# EAGLE schematic M1709 (EAGLE 6.6.0)

## Sheet 1 of 3
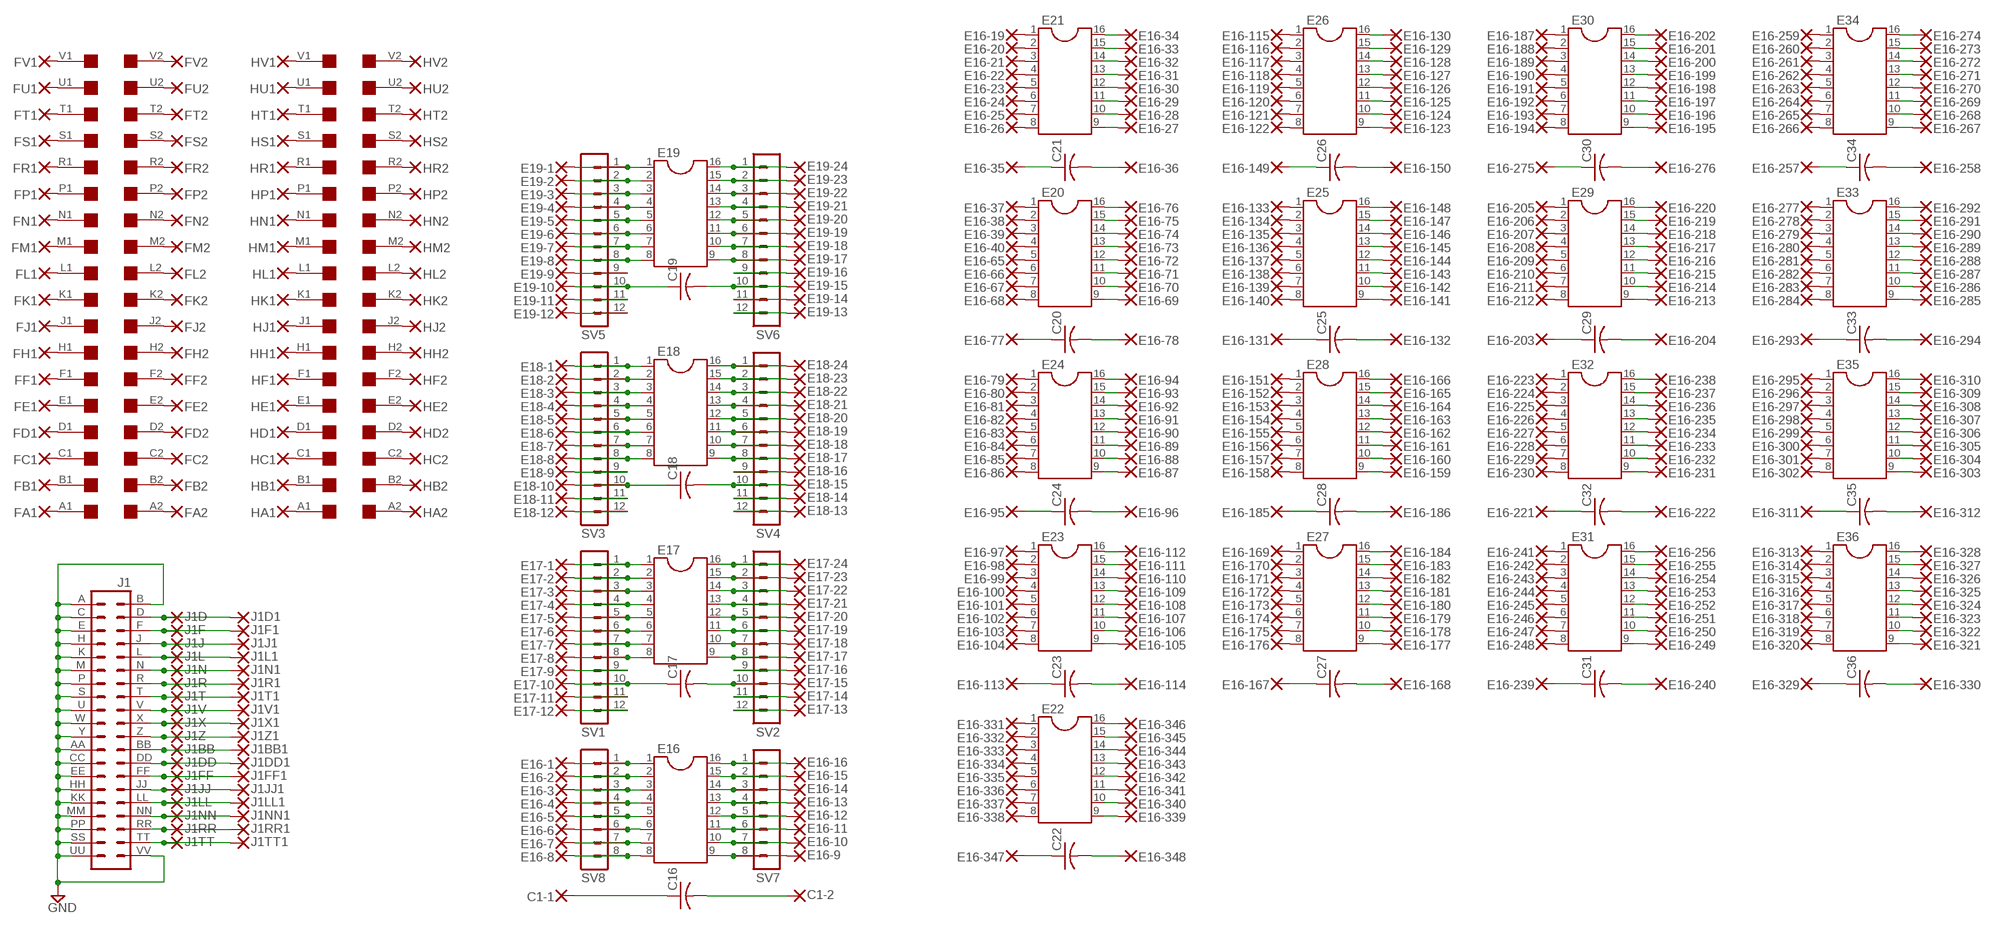
[diagram p0: schematic, sheet 1]

### Parts
C1-1  1,6/0,8  [1,6/0,8]
C1-2  1,6/0,8  [1,6/0,8]
C16  C-US075-032X103  [C075-032X103]
C17  C-US075-032X103  [C075-032X103]
C18  C-US075-032X103  [C075-032X103]
C19  C-US075-032X103  [C075-032X103]
C20  C-US075-032X103  [C075-032X103]
C21  C-US075-032X103  [C075-032X103]
C22  C-US075-032X103  [C075-032X103]
C23  C-US075-032X103  [C075-032X103]
C24  C-US075-032X103  [C075-032X103]
C25  C-US075-032X103  [C075-032X103]
C26  C-US075-032X103  [C075-032X103]
C27  C-US075-032X103  [C075-032X103]
C28  C-US075-032X103  [C075-032X103]
C29  C-US075-032X103  [C075-032X103]
C30  C-US075-032X103  [C075-032X103]
C31  C-US075-032X103  [C075-032X103]
C32  C-US075-032X103  [C075-032X103]
C33  C-US075-032X103  [C075-032X103]
C34  C-US075-032X103  [C075-032X103]
C35  C-US075-032X103  [C075-032X103]
C36  C-US075-032X103  [C075-032X103]
E16  DIL16  [DIL16]
E16-1  1,6/0,8  [1,6/0,8]
E16-2  1,6/0,8  [1,6/0,8]
E16-3  1,6/0,8  [1,6/0,8]
E16-4  1,6/0,8  [1,6/0,8]
E16-5  1,6/0,8  [1,6/0,8]
E16-6  1,6/0,8  [1,6/0,8]
E16-7  1,6/0,8  [1,6/0,8]
E16-8  1,6/0,8  [1,6/0,8]
E16-9  1,6/0,8  [1,6/0,8]
E16-10  1,6/0,8  [1,6/0,8]
E16-11  1,6/0,8  [1,6/0,8]
E16-12  1,6/0,8  [1,6/0,8]
E16-13  1,6/0,8  [1,6/0,8]
E16-14  1,6/0,8  [1,6/0,8]
E16-15  1,6/0,8  [1,6/0,8]
E16-16  1,6/0,8  [1,6/0,8]
E16-19  2,54/0,8  [2,54/0,8]
E16-20  2,54/0,8  [2,54/0,8]
E16-21  2,54/0,8  [2,54/0,8]
E16-22  2,54/0,8  [2,54/0,8]
E16-23  2,54/0,8  [2,54/0,8]
E16-24  2,54/0,8  [2,54/0,8]
E16-25  2,54/0,8  [2,54/0,8]
E16-26  2,54/0,8  [2,54/0,8]
E16-27  2,54/0,8  [2,54/0,8]
E16-28  2,54/0,8  [2,54/0,8]
E16-29  2,54/0,8  [2,54/0,8]
E16-30  2,54/0,8  [2,54/0,8]
E16-31  2,54/0,8  [2,54/0,8]
E16-32  2,54/0,8  [2,54/0,8]
E16-33  2,54/0,8  [2,54/0,8]
E16-34  2,54/0,8  [2,54/0,8]
E16-35  2,54/0,8  [2,54/0,8]
E16-36  2,54/0,8  [2,54/0,8]
E16-37  2,54/0,8  [2,54/0,8]
E16-38  2,54/0,8  [2,54/0,8]
E16-39  2,54/0,8  [2,54/0,8]
E16-40  2,54/0,8  [2,54/0,8]
E16-65  2,54/0,8  [2,54/0,8]
E16-66  2,54/0,8  [2,54/0,8]
E16-67  2,54/0,8  [2,54/0,8]
E16-68  2,54/0,8  [2,54/0,8]
E16-69  2,54/0,8  [2,54/0,8]
E16-70  2,54/0,8  [2,54/0,8]
E16-71  2,54/0,8  [2,54/0,8]
E16-72  2,54/0,8  [2,54/0,8]
E16-73  2,54/0,8  [2,54/0,8]
E16-74  2,54/0,8  [2,54/0,8]
E16-75  2,54/0,8  [2,54/0,8]
E16-76  2,54/0,8  [2,54/0,8]
E16-77  2,54/0,8  [2,54/0,8]
E16-78  2,54/0,8  [2,54/0,8]
E16-79  2,54/0,8  [2,54/0,8]
E16-80  2,54/0,8  [2,54/0,8]
E16-81  2,54/0,8  [2,54/0,8]
E16-82  2,54/0,8  [2,54/0,8]
E16-83  2,54/0,8  [2,54/0,8]
E16-84  2,54/0,8  [2,54/0,8]
E16-85  2,54/0,8  [2,54/0,8]
E16-86  2,54/0,8  [2,54/0,8]
E16-87  2,54/0,8  [2,54/0,8]
E16-88  2,54/0,8  [2,54/0,8]
E16-89  2,54/0,8  [2,54/0,8]
E16-90  2,54/0,8  [2,54/0,8]
E16-91  2,54/0,8  [2,54/0,8]
E16-92  2,54/0,8  [2,54/0,8]
E16-93  2,54/0,8  [2,54/0,8]
E16-94  2,54/0,8  [2,54/0,8]
E16-95  2,54/0,8  [2,54/0,8]
E16-96  2,54/0,8  [2,54/0,8]
E16-97  2,54/0,8  [2,54/0,8]
E16-98  2,54/0,8  [2,54/0,8]
E16-99  2,54/0,8  [2,54/0,8]
E16-100  2,54/0,8  [2,54/0,8]
E16-101  2,54/0,8  [2,54/0,8]
E16-102  2,54/0,8  [2,54/0,8]
E16-103  2,54/0,8  [2,54/0,8]
E16-104  2,54/0,8  [2,54/0,8]
E16-105  2,54/0,8  [2,54/0,8]
E16-106  2,54/0,8  [2,54/0,8]
E16-107  2,54/0,8  [2,54/0,8]
E16-108  2,54/0,8  [2,54/0,8]
E16-109  2,54/0,8  [2,54/0,8]
E16-110  2,54/0,8  [2,54/0,8]
E16-111  2,54/0,8  [2,54/0,8]
E16-112  2,54/0,8  [2,54/0,8]
E16-113  2,54/0,8  [2,54/0,8]
E16-114  2,54/0,8  [2,54/0,8]
E16-115  2,54/0,8  [2,54/0,8]
E16-116  2,54/0,8  [2,54/0,8]
E16-117  2,54/0,8  [2,54/0,8]
E16-118  2,54/0,8  [2,54/0,8]
E16-119  2,54/0,8  [2,54/0,8]
E16-120  2,54/0,8  [2,54/0,8]
E16-121  2,54/0,8  [2,54/0,8]
E16-122  2,54/0,8  [2,54/0,8]
E16-123  2,54/0,8  [2,54/0,8]
E16-124  2,54/0,8  [2,54/0,8]
E16-125  2,54/0,8  [2,54/0,8]
E16-126  2,54/0,8  [2,54/0,8]
E16-127  2,54/0,8  [2,54/0,8]
E16-128  2,54/0,8  [2,54/0,8]
E16-129  2,54/0,8  [2,54/0,8]
E16-130  2,54/0,8  [2,54/0,8]
E16-131  2,54/0,8  [2,54/0,8]
E16-132  2,54/0,8  [2,54/0,8]
E16-133  2,54/0,8  [2,54/0,8]
E16-134  2,54/0,8  [2,54/0,8]
E16-135  2,54/0,8  [2,54/0,8]
E16-136  2,54/0,8  [2,54/0,8]
E16-137  2,54/0,8  [2,54/0,8]
E16-138  2,54/0,8  [2,54/0,8]
E16-139  2,54/0,8  [2,54/0,8]
E16-140  2,54/0,8  [2,54/0,8]
E16-141  2,54/0,8  [2,54/0,8]
E16-142  2,54/0,8  [2,54/0,8]
E16-143  2,54/0,8  [2,54/0,8]
E16-144  2,54/0,8  [2,54/0,8]
E16-145  2,54/0,8  [2,54/0,8]
E16-146  2,54/0,8  [2,54/0,8]
E16-147  2,54/0,8  [2,54/0,8]
E16-148  2,54/0,8  [2,54/0,8]
E16-149  2,54/0,8  [2,54/0,8]
E16-150  2,54/0,8  [2,54/0,8]
E16-151  2,54/0,8  [2,54/0,8]
E16-152  2,54/0,8  [2,54/0,8]
E16-153  2,54/0,8  [2,54/0,8]
E16-154  2,54/0,8  [2,54/0,8]
E16-155  2,54/0,8  [2,54/0,8]
E16-156  2,54/0,8  [2,54/0,8]
E16-157  2,54/0,8  [2,54/0,8]
E16-158  2,54/0,8  [2,54/0,8]
E16-159  2,54/0,8  [2,54/0,8]
E16-160  2,54/0,8  [2,54/0,8]
E16-161  2,54/0,8  [2,54/0,8]
E16-162  2,54/0,8  [2,54/0,8]
E16-163  2,54/0,8  [2,54/0,8]
E16-164  2,54/0,8  [2,54/0,8]
E16-165  2,54/0,8  [2,54/0,8]
E16-166  2,54/0,8  [2,54/0,8]
E16-167  2,54/0,8  [2,54/0,8]
E16-168  2,54/0,8  [2,54/0,8]
E16-169  2,54/0,8  [2,54/0,8]
E16-170  2,54/0,8  [2,54/0,8]
E16-171  2,54/0,8  [2,54/0,8]
E16-172  2,54/0,8  [2,54/0,8]
E16-173  2,54/0,8  [2,54/0,8]
E16-174  2,54/0,8  [2,54/0,8]
E16-175  2,54/0,8  [2,54/0,8]
E16-176  2,54/0,8  [2,54/0,8]
E16-177  2,54/0,8  [2,54/0,8]
E16-178  2,54/0,8  [2,54/0,8]
E16-179  2,54/0,8  [2,54/0,8]
E16-180  2,54/0,8  [2,54/0,8]
E16-181  2,54/0,8  [2,54/0,8]
E16-182  2,54/0,8  [2,54/0,8]
E16-183  2,54/0,8  [2,54/0,8]
E16-184  2,54/0,8  [2,54/0,8]
E16-185  2,54/0,8  [2,54/0,8]
E16-186  2,54/0,8  [2,54/0,8]
E16-187  2,54/0,8  [2,54/0,8]
E16-188  2,54/0,8  [2,54/0,8]
E16-189  2,54/0,8  [2,54/0,8]
E16-190  2,54/0,8  [2,54/0,8]
E16-191  2,54/0,8  [2,54/0,8]
E16-192  2,54/0,8  [2,54/0,8]
E16-193  2,54/0,8  [2,54/0,8]
E16-194  2,54/0,8  [2,54/0,8]
E16-195  2,54/0,8  [2,54/0,8]
E16-196  2,54/0,8  [2,54/0,8]
E16-197  2,54/0,8  [2,54/0,8]
E16-198  2,54/0,8  [2,54/0,8]
E16-199  2,54/0,8  [2,54/0,8]
E16-200  2,54/0,8  [2,54/0,8]
E16-201  2,54/0,8  [2,54/0,8]
E16-202  2,54/0,8  [2,54/0,8]
E16-203  2,54/0,8  [2,54/0,8]
E16-204  2,54/0,8  [2,54/0,8]
E16-205  2,54/0,8  [2,54/0,8]
E16-206  2,54/0,8  [2,54/0,8]
E16-207  2,54/0,8  [2,54/0,8]
E16-208  2,54/0,8  [2,54/0,8]
E16-209  2,54/0,8  [2,54/0,8]
E16-210  2,54/0,8  [2,54/0,8]
E16-211  2,54/0,8  [2,54/0,8]
E16-212  2,54/0,8  [2,54/0,8]
E16-213  2,54/0,8  [2,54/0,8]
E16-214  2,54/0,8  [2,54/0,8]
E16-215  2,54/0,8  [2,54/0,8]
E16-216  2,54/0,8  [2,54/0,8]
E16-217  2,54/0,8  [2,54/0,8]
E16-218  2,54/0,8  [2,54/0,8]
E16-219  2,54/0,8  [2,54/0,8]
E16-220  2,54/0,8  [2,54/0,8]
E16-221  2,54/0,8  [2,54/0,8]
E16-222  2,54/0,8  [2,54/0,8]
E16-223  2,54/0,8  [2,54/0,8]
E16-224  2,54/0,8  [2,54/0,8]
E16-225  2,54/0,8  [2,54/0,8]
E16-226  2,54/0,8  [2,54/0,8]
E16-227  2,54/0,8  [2,54/0,8]
E16-228  2,54/0,8  [2,54/0,8]
E16-229  2,54/0,8  [2,54/0,8]
E16-230  2,54/0,8  [2,54/0,8]
E16-231  2,54/0,8  [2,54/0,8]
E16-232  2,54/0,8  [2,54/0,8]
E16-233  2,54/0,8  [2,54/0,8]
E16-234  2,54/0,8  [2,54/0,8]
E16-235  2,54/0,8  [2,54/0,8]
E16-236  2,54/0,8  [2,54/0,8]
E16-237  2,54/0,8  [2,54/0,8]
E16-238  2,54/0,8  [2,54/0,8]
E16-239  2,54/0,8  [2,54/0,8]
E16-240  2,54/0,8  [2,54/0,8]
E16-241  2,54/0,8  [2,54/0,8]
E16-242  2,54/0,8  [2,54/0,8]
E16-243  2,54/0,8  [2,54/0,8]
E16-244  2,54/0,8  [2,54/0,8]
E16-245  2,54/0,8  [2,54/0,8]
E16-246  2,54/0,8  [2,54/0,8]
E16-247  2,54/0,8  [2,54/0,8]
E16-248  2,54/0,8  [2,54/0,8]
E16-249  2,54/0,8  [2,54/0,8]
E16-250  2,54/0,8  [2,54/0,8]
E16-251  2,54/0,8  [2,54/0,8]
E16-252  2,54/0,8  [2,54/0,8]
E16-253  2,54/0,8  [2,54/0,8]
E16-254  2,54/0,8  [2,54/0,8]
E16-255  2,54/0,8  [2,54/0,8]
E16-256  2,54/0,8  [2,54/0,8]
E16-257  2,54/0,8  [2,54/0,8]
E16-258  2,54/0,8  [2,54/0,8]
E16-259  2,54/0,8  [2,54/0,8]
E16-260  2,54/0,8  [2,54/0,8]
E16-261  2,54/0,8  [2,54/0,8]
E16-262  2,54/0,8  [2,54/0,8]
E16-263  2,54/0,8  [2,54/0,8]
E16-264  2,54/0,8  [2,54/0,8]
E16-265  2,54/0,8  [2,54/0,8]
E16-266  2,54/0,8  [2,54/0,8]
E16-267  2,54/0,8  [2,54/0,8]
E16-268  2,54/0,8  [2,54/0,8]
E16-269  2,54/0,8  [2,54/0,8]
E16-270  2,54/0,8  [2,54/0,8]
E16-271  2,54/0,8  [2,54/0,8]
E16-272  2,54/0,8  [2,54/0,8]
E16-273  2,54/0,8  [2,54/0,8]
E16-274  2,54/0,8  [2,54/0,8]
E16-275  2,54/0,8  [2,54/0,8]
E16-276  2,54/0,8  [2,54/0,8]
E16-277  2,54/0,8  [2,54/0,8]
E16-278  2,54/0,8  [2,54/0,8]
E16-279  2,54/0,8  [2,54/0,8]
E16-280  2,54/0,8  [2,54/0,8]
E16-281  2,54/0,8  [2,54/0,8]
E16-282  2,54/0,8  [2,54/0,8]
E16-283  2,54/0,8  [2,54/0,8]
E16-284  2,54/0,8  [2,54/0,8]
E16-285  2,54/0,8  [2,54/0,8]
E16-286  2,54/0,8  [2,54/0,8]
E16-287  2,54/0,8  [2,54/0,8]
E16-288  2,54/0,8  [2,54/0,8]
E16-289  2,54/0,8  [2,54/0,8]
E16-290  2,54/0,8  [2,54/0,8]
E16-291  2,54/0,8  [2,54/0,8]
E16-292  2,54/0,8  [2,54/0,8]
E16-293  2,54/0,8  [2,54/0,8]
E16-294  2,54/0,8  [2,54/0,8]
E16-295  2,54/0,8  [2,54/0,8]
E16-296  2,54/0,8  [2,54/0,8]
E16-297  2,54/0,8  [2,54/0,8]
E16-298  2,54/0,8  [2,54/0,8]
E16-299  2,54/0,8  [2,54/0,8]
E16-300  2,54/0,8  [2,54/0,8]
E16-301  2,54/0,8  [2,54/0,8]
E16-302  2,54/0,8  [2,54/0,8]
E16-303  2,54/0,8  [2,54/0,8]
E16-304  2,54/0,8  [2,54/0,8]
E16-305  2,54/0,8  [2,54/0,8]
E16-306  2,54/0,8  [2,54/0,8]
E16-307  2,54/0,8  [2,54/0,8]
E16-308  2,54/0,8  [2,54/0,8]
E16-309  2,54/0,8  [2,54/0,8]
E16-310  2,54/0,8  [2,54/0,8]
E16-311  2,54/0,8  [2,54/0,8]
E16-312  2,54/0,8  [2,54/0,8]
E16-313  2,54/0,8  [2,54/0,8]
E16-314  2,54/0,8  [2,54/0,8]
E16-315  2,54/0,8  [2,54/0,8]
E16-316  2,54/0,8  [2,54/0,8]
E16-317  2,54/0,8  [2,54/0,8]
E16-318  2,54/0,8  [2,54/0,8]
E16-319  2,54/0,8  [2,54/0,8]
E16-320  2,54/0,8  [2,54/0,8]
E16-321  2,54/0,8  [2,54/0,8]
E16-322  2,54/0,8  [2,54/0,8]
E16-323  2,54/0,8  [2,54/0,8]
E16-324  2,54/0,8  [2,54/0,8]
E16-325  2,54/0,8  [2,54/0,8]
E16-326  2,54/0,8  [2,54/0,8]
E16-327  2,54/0,8  [2,54/0,8]
E16-328  2,54/0,8  [2,54/0,8]
E16-329  2,54/0,8  [2,54/0,8]
E16-330  2,54/0,8  [2,54/0,8]
E16-331  2,54/0,8  [2,54/0,8]
E16-332  2,54/0,8  [2,54/0,8]
E16-333  2,54/0,8  [2,54/0,8]
E16-334  2,54/0,8  [2,54/0,8]
E16-335  2,54/0,8  [2,54/0,8]
E16-336  2,54/0,8  [2,54/0,8]
E16-337  2,54/0,8  [2,54/0,8]
E16-338  2,54/0,8  [2,54/0,8]
E16-339  2,54/0,8  [2,54/0,8]
E16-340  2,54/0,8  [2,54/0,8]
E16-341  2,54/0,8  [2,54/0,8]
E16-342  2,54/0,8  [2,54/0,8]
E16-343  2,54/0,8  [2,54/0,8]
E16-344  2,54/0,8  [2,54/0,8]
E16-345  2,54/0,8  [2,54/0,8]
E16-346  2,54/0,8  [2,54/0,8]
E16-347  2,54/0,8  [2,54/0,8]
E16-348  2,54/0,8  [2,54/0,8]
E17  DIL16  [DIL16]
E17-1  1,6/0,8  [1,6/0,8]
E17-2  1,6/0,8  [1,6/0,8]
E17-3  1,6/0,8  [1,6/0,8]
E17-4  1,6/0,8  [1,6/0,8]
E17-5  1,6/0,8  [1,6/0,8]
E17-6  1,6/0,8  [1,6/0,8]
E17-7  1,6/0,8  [1,6/0,8]
E17-8  1,6/0,8  [1,6/0,8]
E17-9  1,6/0,8  [1,6/0,8]
E17-10  1,6/0,8  [1,6/0,8]
E17-11  1,6/0,8  [1,6/0,8]
E17-12  1,6/0,8  [1,6/0,8]
E17-13  1,6/0,8  [1,6/0,8]
E17-14  1,6/0,8  [1,6/0,8]
E17-15  1,6/0,8  [1,6/0,8]
E17-16  1,6/0,8  [1,6/0,8]
E17-17  1,6/0,8  [1,6/0,8]
E17-18  1,6/0,8  [1,6/0,8]
E17-19  1,6/0,8  [1,6/0,8]
E17-20  1,6/0,8  [1,6/0,8]
E17-21  1,6/0,8  [1,6/0,8]
E17-22  1,6/0,8  [1,6/0,8]
E17-23  1,6/0,8  [1,6/0,8]
E17-24  1,6/0,8  [1,6/0,8]
E18  DIL16  [DIL16]
E18-1  1,6/0,8  [1,6/0,8]
E18-2  1,6/0,8  [1,6/0,8]
E18-3  1,6/0,8  [1,6/0,8]
E18-4  1,6/0,8  [1,6/0,8]
E18-5  1,6/0,8  [1,6/0,8]
E18-6  1,6/0,8  [1,6/0,8]
E18-7  1,6/0,8  [1,6/0,8]
E18-8  1,6/0,8  [1,6/0,8]
E18-9  1,6/0,8  [1,6/0,8]
E18-10  1,6/0,8  [1,6/0,8]
E18-11  1,6/0,8  [1,6/0,8]
E18-12  1,6/0,8  [1,6/0,8]
E18-13  1,6/0,8  [1,6/0,8]
E18-14  1,6/0,8  [1,6/0,8]
E18-15  1,6/0,8  [1,6/0,8]
E18-16  1,6/0,8  [1,6/0,8]
E18-17  1,6/0,8  [1,6/0,8]
E18-18  1,6/0,8  [1,6/0,8]
E18-19  1,6/0,8  [1,6/0,8]
E18-20  1,6/0,8  [1,6/0,8]
E18-21  1,6/0,8  [1,6/0,8]
E18-22  1,6/0,8  [1,6/0,8]
E18-23  1,6/0,8  [1,6/0,8]
E18-24  1,6/0,8  [1,6/0,8]
E19  DIL16  [DIL16]
E19-1  1,6/0,8  [1,6/0,8]
E19-2  1,6/0,8  [1,6/0,8]
E19-3  1,6/0,8  [1,6/0,8]
E19-4  1,6/0,8  [1,6/0,8]
E19-5  1,6/0,8  [1,6/0,8]
E19-6  1,6/0,8  [1,6/0,8]
E19-7  1,6/0,8  [1,6/0,8]
E19-8  1,6/0,8  [1,6/0,8]
E19-9  1,6/0,8  [1,6/0,8]
E19-10  1,6/0,8  [1,6/0,8]
E19-11  1,6/0,8  [1,6/0,8]
E19-12  1,6/0,8  [1,6/0,8]
E19-13  1,6/0,8  [1,6/0,8]
E19-14  1,6/0,8  [1,6/0,8]
E19-15  1,6/0,8  [1,6/0,8]
E19-16  1,6/0,8  [1,6/0,8]
E19-17  1,6/0,8  [1,6/0,8]
E19-18  1,6/0,8  [1,6/0,8]
E19-19  1,6/0,8  [1,6/0,8]
E19-20  1,6/0,8  [1,6/0,8]
E19-21  1,6/0,8  [1,6/0,8]
E19-22  1,6/0,8  [1,6/0,8]
E19-23  1,6/0,8  [1,6/0,8]
E19-24  1,6/0,8  [1,6/0,8]
E20  DIL16  [DIL16]
E21  DIL16  [DIL16]
E22  DIL16  [DIL16]
E23  DIL16  [DIL16]
E24  DIL16  [DIL16]
E25  DIL16  [DIL16]
E26  DIL16  [DIL16]
E27  DIL16  [DIL16]
E28  DIL16  [DIL16]
E29  DIL16  [DIL16]
E30  DIL16  [DIL16]
E31  DIL16  [DIL16]
E32  DIL16  [DIL16]
E33  DIL16  [DIL16]
E34  DIL16  [DIL16]
E35  DIL16  [DIL16]
E36  DIL16  [DIL16]
F  SINGLE  [EDGE-CON2]
FA1  2,54/0,8  [2,54/0,8]
FA2  2,54/0,8  [2,54/0,8]
FB1  2,54/0,8  [2,54/0,8]
FB2  2,54/0,8  [2,54/0,8]
FC1  2,54/0,8  [2,54/0,8]
FC2  2,54/0,8  [2,54/0,8]
FD1  2,54/0,8  [2,54/0,8]
FD2  2,54/0,8  [2,54/0,8]
FE1  2,54/0,8  [2,54/0,8]
FE2  2,54/0,8  [2,54/0,8]
FF1  2,54/0,8  [2,54/0,8]
FF2  2,54/0,8  [2,54/0,8]
FH1  2,54/0,8  [2,54/0,8]
FH2  2,54/0,8  [2,54/0,8]
FJ1  2,54/0,8  [2,54/0,8]
FJ2  2,54/0,8  [2,54/0,8]
FK1  2,54/0,8  [2,54/0,8]
FK2  2,54/0,8  [2,54/0,8]
FL1  2,54/0,8  [2,54/0,8]
FL2  2,54/0,8  [2,54/0,8]
FM1  2,54/0,8  [2,54/0,8]
FM2  2,54/0,8  [2,54/0,8]
FN1  2,54/0,8  [2,54/0,8]
FN2  2,54/0,8  [2,54/0,8]
FP1  2,54/0,8  [2,54/0,8]
FP2  2,54/0,8  [2,54/0,8]
FR1  2,54/0,8  [2,54/0,8]
FR2  2,54/0,8  [2,54/0,8]
FS1  2,54/0,8  [2,54/0,8]
FS2  2,54/0,8  [2,54/0,8]
FT1  2,54/0,8  [2,54/0,8]
FT2  2,54/0,8  [2,54/0,8]
FU1  2,54/0,8  [2,54/0,8]
FU2  2,54/0,8  [2,54/0,8]
FV1  2,54/0,8  [2,54/0,8]
FV2  2,54/0,8  [2,54/0,8]
H  SINGLE  [EDGE-CON2]
HA1  2,54/0,8  [2,54/0,8]
HA2  2,54/0,8  [2,54/0,8]
HB1  2,54/0,8  [2,54/0,8]
HB2  2,54/0,8  [2,54/0,8]
HC1  2,54/0,8  [2,54/0,8]
HC2  2,54/0,8  [2,54/0,8]
HD1  2,54/0,8  [2,54/0,8]
HD2  2,54/0,8  [2,54/0,8]
HE1  2,54/0,8  [2,54/0,8]
HE2  2,54/0,8  [2,54/0,8]
HF1  2,54/0,8  [2,54/0,8]
HF2  2,54/0,8  [2,54/0,8]
HH1  2,54/0,8  [2,54/0,8]
HH2  2,54/0,8  [2,54/0,8]
HJ1  2,54/0,8  [2,54/0,8]
HJ2  2,54/0,8  [2,54/0,8]
HK1  2,54/0,8  [2,54/0,8]
HK2  2,54/0,8  [2,54/0,8]
HL1  2,54/0,8  [2,54/0,8]
HL2  2,54/0,8  [2,54/0,8]
HM1  2,54/0,8  [2,54/0,8]
HM2  2,54/0,8  [2,54/0,8]
HN1  2,54/0,8  [2,54/0,8]
HN2  2,54/0,8  [2,54/0,8]
HP1  2,54/0,8  [2,54/0,8]
HP2  2,54/0,8  [2,54/0,8]
HR1  2,54/0,8  [2,54/0,8]
HR2  2,54/0,8  [2,54/0,8]
HS1  2,54/0,8  [2,54/0,8]
HS2  2,54/0,8  [2,54/0,8]
HT1  2,54/0,8  [2,54/0,8]
HT2  2,54/0,8  [2,54/0,8]
HU1  2,54/0,8  [2,54/0,8]
HU2  2,54/0,8  [2,54/0,8]
HV1  2,54/0,8  [2,54/0,8]
HV2  2,54/0,8  [2,54/0,8]
J1  DEC40PINH  [DEC40PINH]
J1BB  2,54/0,8  [2,54/0,8]
J1BB1  2,54/0,8  [2,54/0,8]
J1D  2,54/0,8  [2,54/0,8]
J1D1  2,54/0,8  [2,54/0,8]
J1DD  2,54/0,8  [2,54/0,8]
J1DD1  2,54/0,8  [2,54/0,8]
J1F  2,54/0,8  [2,54/0,8]
J1F1  2,54/0,8  [2,54/0,8]
J1FF  2,54/0,8  [2,54/0,8]
J1FF1  2,54/0,8  [2,54/0,8]
J1J  2,54/0,8  [2,54/0,8]
J1J1  2,54/0,8  [2,54/0,8]
J1JJ  2,54/0,8  [2,54/0,8]
J1JJ1  2,54/0,8  [2,54/0,8]
J1L  2,54/0,8  [2,54/0,8]
J1L1  2,54/0,8  [2,54/0,8]
J1LL  2,54/0,8  [2,54/0,8]
J1LL1  2,54/0,8  [2,54/0,8]
J1N  2,54/0,8  [2,54/0,8]
J1N1  2,54/0,8  [2,54/0,8]
J1NN  2,54/0,8  [2,54/0,8]
J1NN1  2,54/0,8  [2,54/0,8]
J1R  2,54/0,8  [2,54/0,8]
J1R1  2,54/0,8  [2,54/0,8]
J1RR  2,54/0,8  [2,54/0,8]
J1RR1  2,54/0,8  [2,54/0,8]
J1T  2,54/0,8  [2,54/0,8]
J1T1  2,54/0,8  [2,54/0,8]
J1TT  2,54/0,8  [2,54/0,8]
J1TT1  2,54/0,8  [2,54/0,8]
J1V  2,54/0,8  [2,54/0,8]
J1V1  2,54/0,8  [2,54/0,8]
J1X  2,54/0,8  [2,54/0,8]
J1X1  2,54/0,8  [2,54/0,8]
J1Z  2,54/0,8  [2,54/0,8]
J1Z1  2,54/0,8  [2,54/0,8]
SV1  MA12-1  [MA12-1]
SV2  MA12-1  [MA12-1]
SV3  MA12-1  [MA12-1]
SV4  MA12-1  [MA12-1]
SV5  MA12-1  [MA12-1]
SV6  MA12-1  [MA12-1]
SV7  MA08-1  [MA08-1]
SV8  MA08-1  [MA08-1]

### Nets
GND: J1.A J1.AA J1.B J1.C J1.CC J1.E J1.EE J1.H J1.HH J1.K J1.KK J1.M J1.MM J1.P J1.PP J1.S J1.SS J1.U J1.UU J1.VV J1.W J1.Y ; also sheet 2,3
N$1: J1.D J1D1.1(P) J1D.1(P)
N$2: J1.F J1F1.1(P) J1F.1(P)
N$3: J1.J J1J1.1(P) J1J.1(P)
N$4: J1.L J1L1.1(P) J1L.1(P)
N$5: J1.N J1N1.1(P) J1N.1(P)
N$6: J1.R J1R1.1(P) J1R.1(P)
N$7: J1.T J1T1.1(P) J1T.1(P)
N$8: J1.V J1V1.1(P) J1V.1(P)
N$9: J1.X J1X1.1(P) J1X.1(P)
N$10: J1.Z J1Z1.1(P) J1Z.1(P)
N$11: J1.BB J1BB1.1(P) J1BB.1(P)
N$12: J1.DD J1DD1.1(P) J1DD.1(P)
N$13: J1.FF J1FF1.1(P) J1FF.1(P)
N$14: J1.JJ J1JJ1.1(P) J1JJ.1(P)
N$15: J1.LL J1LL1.1(P) J1LL.1(P)
N$16: J1.NN J1NN1.1(P) J1NN.1(P)
N$17: J1.RR J1RR1.1(P) J1RR.1(P)
N$18: J1.TT J1TT1.1(P) J1TT.1(P)
N$19: F.A1 FA1.1(P)
N$20: F.B1 FB1.1(P)
N$21: F.C1 FC1.1(P)
N$22: F.D1 FD1.1(P)
N$23: F.E1 FE1.1(P)
N$24: F.F1 FF1.1(P)
N$25: F.H1 FH1.1(P)
N$26: F.J1 FJ1.1(P)
N$27: F.K1 FK1.1(P)
N$28: F.L1 FL1.1(P)
N$29: F.M1 FM1.1(P)
N$30: F.N1 FN1.1(P)
N$31: F.P1 FP1.1(P)
N$32: F.R1 FR1.1(P)
N$33: F.S1 FS1.1(P)
N$34: F.T1 FT1.1(P)
N$35: F.U1 FU1.1(P)
N$36: F.V1 FV1.1(P)
N$37: F.A2 FA2.1(P)
N$38: F.B2 FB2.1(P)
N$39: F.C2 FC2.1(P)
N$40: F.D2 FD2.1(P)
N$41: F.E2 FE2.1(P)
N$42: F.F2 FF2.1(P)
N$43: F.H2 FH2.1(P)
N$44: F.J2 FJ2.1(P)
N$45: F.K2 FK2.1(P)
N$46: F.L2 FL2.1(P)
N$47: F.M2 FM2.1(P)
N$48: F.N2 FN2.1(P)
N$49: F.P2 FP2.1(P)
N$50: F.R2 FR2.1(P)
N$51: F.S2 FS2.1(P)
N$52: F.T2 FT2.1(P)
N$53: F.U2 FU2.1(P)
N$54: F.V2 FV2.1(P)
N$55: H.A2 HA2.1(P)
N$56: H.B2 HB2.1(P)
N$57: H.C2 HC2.1(P)
N$58: H.D2 HD2.1(P)
N$59: H.E2 HE2.1(P)
N$60: H.F2 HF2.1(P)
N$61: H.H2 HH2.1(P)
N$62: H.J2 HJ2.1(P)
N$63: H.K2 HK2.1(P)
N$64: H.L2 HL2.1(P)
N$65: H.M2 HM2.1(P)
N$66: H.N2 HN2.1(P)
N$67: H.P2 HP2.1(P)
N$68: H.R2 HR2.1(P)
N$69: H.S2 HS2.1(P)
N$70: H.T2 HT2.1(P)
N$71: H.U2 HU2.1(P)
N$72: H.V2 HV2.1(P)
N$73: H.A1 HA1.1(P)
N$74: H.B1 HB1.1(P)
N$75: H.C1 HC1.1(P)
N$76: H.D1 HD1.1(P)
N$77: H.E1 HE1.1(P)
N$78: H.F1 HF1.1(P)
N$79: H.H1 HH1.1(P)
N$80: H.J1 HJ1.1(P)
N$81: H.K1 HK1.1(P)
N$82: H.L1 HL1.1(P)
N$83: H.M1 HM1.1(P)
N$84: H.N1 HN1.1(P)
N$85: H.P1 HP1.1(P)
N$86: H.R1 HR1.1(P)
N$87: H.S1 HS1.1(P)
N$88: H.T1 HT1.1(P)
N$89: H.U1 HU1.1(P)
N$90: H.V1 HV1.1(P)
N$91: E17-1.1(P) E17.1 SV1.1
N$92: E17-2.1(P) E17.2 SV1.2
N$93: E17-3.1(P) E17.3 SV1.3
N$94: E17-4.1(P) E17.4 SV1.4
N$95: E17-5.1(P) E17.5 SV1.5
N$96: E17-6.1(P) E17.6 SV1.6
N$97: E17-7.1(P) E17.7 SV1.7
N$98: E17-8.1(P) E17.8 SV1.8
N$99: E17-9.1(P) SV1.9
N$100: C17.1 E17-10.1(P) SV1.10
N$101: C17.2 E17-15.1(P) SV2.10
N$102: E17-16.1(P) SV2.9
N$103: E17-17.1(P) E17.9 SV2.8
N$104: E17-18.1(P) E17.10 SV2.7
N$105: E17-19.1(P) E17.11 SV2.6
N$106: E17-20.1(P) E17.12 SV2.5
N$107: E17-21.1(P) E17.13 SV2.4
N$108: E17-22.1(P) E17.14 SV2.3
N$109: E17-23.1(P) E17.15 SV2.2
N$110: E17-24.1(P) E17.16 SV2.1
N$111: E18-11.1(P) SV3.11
N$112: E18-12.1(P) SV3.12
N$113: E18-13.1(P) SV4.12
N$114: E18-14.1(P) SV4.11
N$115: E18-1.1(P) E18.1 SV3.1
N$116: E18-2.1(P) E18.2 SV3.2
N$117: E17-11.1(P) SV1.11
N$118: E17-12.1(P) SV1.12
N$119: E16-1.1(P) E16.1 SV8.1
N$120: E16-2.1(P) E16.2 SV8.2
N$121: E16-3.1(P) E16.3 SV8.3
N$122: E16-4.1(P) E16.4 SV8.4
N$123: E16-5.1(P) E16.5 SV8.5
N$124: E16-6.1(P) E16.6 SV8.6
N$125: E16-7.1(P) E16.7 SV8.7
N$126: E16-8.1(P) E16.8 SV8.8
N$127: E16-9.1(P) E16.9 SV7.8
N$128: E16-10.1(P) E16.10 SV7.7
N$129: E16-11.1(P) E16.11 SV7.6
N$130: E16-12.1(P) E16.12 SV7.5
N$131: E16-13.1(P) E16.13 SV7.4
N$132: E16-14.1(P) E16.14 SV7.3
N$133: E16-15.1(P) E16.15 SV7.2
N$134: E16-16.1(P) E16.16 SV7.1
N$135: E17-13.1(P) SV2.12
N$136: E17-14.1(P) SV2.11
N$137: E18-3.1(P) E18.3 SV3.3
N$138: E18-4.1(P) E18.4 SV3.4
N$139: E18-5.1(P) E18.5 SV3.5
N$140: E18-6.1(P) E18.6 SV3.6
N$141: E18-7.1(P) E18.7 SV3.7
N$142: E18-8.1(P) E18.8 SV3.8
N$143: E18-9.1(P) SV3.9
N$144: C18.1 E18-10.1(P) SV3.10
N$145: C18.2 E18-15.1(P) SV4.10
N$146: E18-16.1(P) SV4.9
N$147: E18-17.1(P) E18.9 SV4.8
N$148: E18-18.1(P) E18.10 SV4.7
N$149: E18-19.1(P) E18.11 SV4.6
N$150: E18-20.1(P) E18.12 SV4.5
N$151: E18-21.1(P) E18.13 SV4.4
N$152: E18-22.1(P) E18.14 SV4.3
N$153: E18-23.1(P) E18.15 SV4.2
N$154: E18-24.1(P) E18.16 SV4.1
N$155: E19-11.1(P) SV5.11
N$156: E19-12.1(P) SV5.12
N$157: E19-13.1(P) SV6.12
N$158: E19-14.1(P) SV6.11
N$159: E19-1.1(P) E19.1 SV5.1
N$160: E19-2.1(P) E19.2 SV5.2
N$161: E19-3.1(P) E19.3 SV5.3
N$162: E19-4.1(P) E19.4 SV5.4
N$163: E19-5.1(P) E19.5 SV5.5
N$164: E19-6.1(P) E19.6 SV5.6
N$165: E19-7.1(P) E19.7 SV5.7
N$166: E19-8.1(P) E19.8 SV5.8
N$167: E19-9.1(P) SV5.9
N$168: C19.1 E19-10.1(P) SV5.10
N$169: C19.2 E19-15.1(P) SV6.10
N$170: E19-16.1(P) SV6.9
N$171: E19-17.1(P) E19.9 SV6.8
N$172: E19-18.1(P) E19.10 SV6.7
N$173: E19-19.1(P) E19.11 SV6.6
N$174: E19-20.1(P) E19.12 SV6.5
N$175: E19-21.1(P) E19.13 SV6.4
N$176: E19-22.1(P) E19.14 SV6.3
N$177: E19-23.1(P) E19.15 SV6.2
N$178: E19-24.1(P) E19.16 SV6.1
N$179: C1-1.1(P) C16.1
N$180: C1-2.1(P) C16.2
N$181: E16-19.1(P) E21.1
N$182: E16-20.1(P) E21.2
N$183: E16-21.1(P) E21.3
N$184: E16-22.1(P) E21.4
N$185: E16-23.1(P) E21.5
N$186: E16-24.1(P) E21.6
N$187: E16-25.1(P) E21.7
N$188: E16-26.1(P) E21.8
N$189: E16-27.1(P) E21.9
N$190: E16-28.1(P) E21.10
N$191: E16-29.1(P) E21.11
N$192: E16-30.1(P) E21.12
N$193: E16-31.1(P) E21.13
N$194: E16-32.1(P) E21.14
N$195: E16-33.1(P) E21.15
N$196: E16-34.1(P) E21.16
N$197: C21.1 E16-35.1(P)
N$198: C21.2 E16-36.1(P)
N$199: E16-37.1(P) E20.1
N$200: E16-38.1(P) E20.2
N$201: E16-39.1(P) E20.3
N$202: E16-40.1(P) E20.4
N$203: E16-65.1(P) E20.5
N$204: E16-66.1(P) E20.6
N$205: E16-67.1(P) E20.7
N$206: E16-68.1(P) E20.8
N$207: E16-69.1(P) E20.9
N$208: E16-70.1(P) E20.10
N$209: E16-71.1(P) E20.11
N$210: E16-72.1(P) E20.12
N$211: E16-73.1(P) E20.13
N$212: E16-74.1(P) E20.14
N$213: E16-75.1(P) E20.15
N$214: E16-76.1(P) E20.16
N$215: C20.1 E16-77.1(P)
N$216: C20.2 E16-78.1(P)
N$217: E16-79.1(P) E24.1
N$218: E16-80.1(P) E24.2
N$219: E16-81.1(P) E24.3
N$220: E16-82.1(P) E24.4
N$221: E16-83.1(P) E24.5
N$222: E16-84.1(P) E24.6
N$223: E16-85.1(P) E24.7
N$224: E16-86.1(P) E24.8
N$225: E16-87.1(P) E24.9
N$226: E16-88.1(P) E24.10
N$227: E16-89.1(P) E24.11
N$228: E16-90.1(P) E24.12
N$229: E16-91.1(P) E24.13
N$230: E16-92.1(P) E24.14
N$231: E16-93.1(P) E24.15
N$232: E16-94.1(P) E24.16
N$233: C24.1 E16-95.1(P)
N$234: C24.2 E16-96.1(P)
N$235: E16-97.1(P) E23.1
N$236: E16-98.1(P) E23.2
N$237: E16-99.1(P) E23.3
N$238: E16-100.1(P) E23.4
N$239: E16-101.1(P) E23.5
N$240: E16-102.1(P) E23.6
N$241: E16-103.1(P) E23.7
N$242: E16-104.1(P) E23.8
N$243: E16-105.1(P) E23.9
N$244: E16-106.1(P) E23.10
N$245: E16-107.1(P) E23.11
N$246: E16-108.1(P) E23.12
N$247: E16-109.1(P) E23.13
N$248: E16-110.1(P) E23.14
N$249: E16-111.1(P) E23.15
N$250: E16-112.1(P) E23.16
N$251: C23.1 E16-113.1(P)
N$252: C23.2 E16-114.1(P)
N$253: E16-115.1(P) E26.1
N$254: E16-116.1(P) E26.2
N$255: E16-117.1(P) E26.3
N$256: E16-118.1(P) E26.4
N$257: E16-119.1(P) E26.5
N$258: E16-120.1(P) E26.6
N$259: E16-121.1(P) E26.7
N$260: E16-122.1(P) E26.8
N$261: E16-123.1(P) E26.9
N$262: E16-124.1(P) E26.10
N$263: E16-125.1(P) E26.11
N$264: E16-126.1(P) E26.12
N$265: E16-127.1(P) E26.13
N$266: E16-128.1(P) E26.14
N$267: E16-129.1(P) E26.15
N$268: E16-130.1(P) E26.16
N$269: C25.1 E16-131.1(P)
N$270: C25.2 E16-132.1(P)
N$271: E16-133.1(P) E25.1
N$272: E16-134.1(P) E25.2
N$273: E16-135.1(P) E25.3
N$274: E16-136.1(P) E25.4
N$275: E16-137.1(P) E25.5
N$276: E16-138.1(P) E25.6
N$277: E16-139.1(P) E25.7
N$278: E16-140.1(P) E25.8
N$279: E16-141.1(P) E25.9
N$280: E16-142.1(P) E25.10
N$281: E16-143.1(P) E25.11
N$282: E16-144.1(P) E25.12
N$283: E16-145.1(P) E25.13
N$284: E16-146.1(P) E25.14
N$285: E16-147.1(P) E25.15
N$286: E16-148.1(P) E25.16
N$287: C26.1 E16-149.1(P)
N$288: C26.2 E16-150.1(P)
N$289: E16-151.1(P) E28.1
N$290: E16-152.1(P) E28.2
N$291: E16-153.1(P) E28.3
N$292: E16-154.1(P) E28.4
N$293: E16-155.1(P) E28.5
N$294: E16-156.1(P) E28.6
N$295: E16-157.1(P) E28.7
N$296: E16-158.1(P) E28.8
N$297: E16-159.1(P) E28.9
N$298: E16-160.1(P) E28.10
N$299: E16-161.1(P) E28.11
N$300: E16-162.1(P) E28.12
N$301: E16-163.1(P) E28.13
N$302: E16-164.1(P) E28.14
N$303: E16-165.1(P) E28.15
N$304: E16-166.1(P) E28.16
N$305: C27.1 E16-167.1(P)
N$306: C27.2 E16-168.1(P)
N$307: E16-169.1(P) E27.1
N$308: E16-170.1(P) E27.2
N$309: E16-171.1(P) E27.3
N$310: E16-172.1(P) E27.4
N$311: E16-173.1(P) E27.5
N$312: E16-174.1(P) E27.6
N$313: E16-175.1(P) E27.7
N$314: E16-176.1(P) E27.8
N$315: E16-177.1(P) E27.9
N$316: E16-178.1(P) E27.10
N$317: E16-179.1(P) E27.11
N$318: E16-180.1(P) E27.12
N$319: E16-181.1(P) E27.13
N$320: E16-182.1(P) E27.14
N$321: E16-183.1(P) E27.15
N$322: E16-184.1(P) E27.16
N$323: C28.1 E16-185.1(P)
N$324: C28.2 E16-186.1(P)
N$325: E16-187.1(P) E30.1
N$326: E16-188.1(P) E30.2
N$327: E16-189.1(P) E30.3
N$328: E16-190.1(P) E30.4
N$329: E16-191.1(P) E30.5
N$330: E16-192.1(P) E30.6
N$331: E16-193.1(P) E30.7
N$332: E16-194.1(P) E30.8
N$333: E16-195.1(P) E30.9
N$334: E16-196.1(P) E30.10
N$335: E16-197.1(P) E30.11
N$336: E16-198.1(P) E30.12
N$337: E16-199.1(P) E30.13
N$338: E16-200.1(P) E30.14
N$339: E16-201.1(P) E30.15
N$340: E16-202.1(P) E30.16
N$341: C29.1 E16-203.1(P)
N$342: C29.2 E16-204.1(P)
N$343: E16-205.1(P) E29.1
N$344: E16-206.1(P) E29.2
N$345: E16-207.1(P) E29.3
N$346: E16-208.1(P) E29.4
N$347: E16-209.1(P) E29.5
N$348: E16-210.1(P) E29.6
N$349: E16-211.1(P) E29.7
N$350: E16-212.1(P) E29.8
N$351: E16-213.1(P) E29.9
N$352: E16-214.1(P) E29.10
N$353: E16-215.1(P) E29.11
N$354: E16-216.1(P) E29.12
N$355: E16-217.1(P) E29.13
N$356: E16-218.1(P) E29.14
N$357: E16-219.1(P) E29.15
N$358: E16-220.1(P) E29.16
N$359: C32.1 E16-221.1(P)
N$360: C32.2 E16-222.1(P)
N$361: E16-223.1(P) E32.1
N$362: E16-224.1(P) E32.2
N$363: E16-225.1(P) E32.3
N$364: E16-226.1(P) E32.4
N$365: E16-227.1(P) E32.5
N$366: E16-228.1(P) E32.6
N$367: E16-229.1(P) E32.7
N$368: E16-230.1(P) E32.8
N$369: E16-231.1(P) E32.9
N$370: E16-232.1(P) E32.10
N$371: E16-233.1(P) E32.11
N$372: E16-234.1(P) E32.12
N$373: E16-235.1(P) E32.13
N$374: E16-236.1(P) E32.14
N$375: E16-237.1(P) E32.15
N$376: E16-238.1(P) E32.16
N$377: C31.1 E16-239.1(P)
N$378: C31.2 E16-240.1(P)
N$379: E16-241.1(P) E31.1
N$380: E16-242.1(P) E31.2
N$381: E16-243.1(P) E31.3
N$382: E16-244.1(P) E31.4
N$383: E16-245.1(P) E31.5
N$384: E16-246.1(P) E31.6
N$385: E16-247.1(P) E31.7
N$386: E16-248.1(P) E31.8
N$387: E16-249.1(P) E31.9
N$388: E16-250.1(P) E31.10
N$389: E16-251.1(P) E31.11
N$390: E16-252.1(P) E31.12
N$391: E16-253.1(P) E31.13
N$392: E16-254.1(P) E31.14
N$393: E16-255.1(P) E31.15
N$394: E16-256.1(P) E31.16
N$395: C34.1 E16-257.1(P)
N$396: C34.2 E16-258.1(P)
N$397: E16-259.1(P) E34.1
N$398: E16-260.1(P) E34.2
N$399: E16-261.1(P) E34.3
N$400: E16-262.1(P) E34.4
N$401: E16-263.1(P) E34.5
N$402: E16-264.1(P) E34.6
N$403: E16-265.1(P) E34.7
N$404: E16-266.1(P) E34.8
N$405: E16-267.1(P) E34.9
N$406: E16-268.1(P) E34.10
N$407: E16-269.1(P) E34.11
N$408: E16-270.1(P) E34.12
N$409: E16-271.1(P) E34.13
N$410: E16-272.1(P) E34.14
N$411: E16-273.1(P) E34.15
N$412: E16-274.1(P) E34.16
N$413: C30.1 E16-275.1(P)
N$414: C30.2 E16-276.1(P)
N$415: E16-277.1(P) E33.1
N$416: E16-278.1(P) E33.2
N$417: E16-279.1(P) E33.3
N$418: E16-280.1(P) E33.4
N$419: E16-281.1(P) E33.5
N$420: E16-282.1(P) E33.6
N$421: E16-283.1(P) E33.7
N$422: E16-284.1(P) E33.8
N$423: E16-285.1(P) E33.9
N$424: E16-286.1(P) E33.10
N$425: E16-287.1(P) E33.11
N$426: E16-288.1(P) E33.12
N$427: E16-289.1(P) E33.13
N$428: E16-290.1(P) E33.14
N$429: E16-291.1(P) E33.15
N$430: E16-292.1(P) E33.16
N$431: C33.1 E16-293.1(P)
N$432: C33.2 E16-294.1(P)
N$433: E16-295.1(P) E35.1
N$434: E16-296.1(P) E35.2
N$435: E16-297.1(P) E35.3
N$436: E16-298.1(P) E35.4
N$437: E16-299.1(P) E35.5
N$438: E16-300.1(P) E35.6
N$439: E16-301.1(P) E35.7
N$440: E16-302.1(P) E35.8
N$441: E16-303.1(P) E35.9
N$442: E16-304.1(P) E35.10
N$443: E16-305.1(P) E35.11
N$444: E16-306.1(P) E35.12
N$445: E16-307.1(P) E35.13
N$446: E16-308.1(P) E35.14
N$447: E16-309.1(P) E35.15
N$448: E16-310.1(P) E35.16
N$449: C35.1 E16-311.1(P)
N$450: C35.2 E16-312.1(P)
N$451: E16-313.1(P) E36.1
N$452: E16-314.1(P) E36.2
N$453: E16-315.1(P) E36.3
N$454: E16-316.1(P) E36.4
N$455: E16-317.1(P) E36.5
N$456: E16-318.1(P) E36.6
N$457: E16-319.1(P) E36.7
N$458: E16-320.1(P) E36.8
N$459: E16-321.1(P) E36.9
N$460: E16-322.1(P) E36.10
N$461: E16-323.1(P) E36.11
N$462: E16-324.1(P) E36.12
N$463: E16-325.1(P) E36.13
N$464: E16-326.1(P) E36.14
N$465: E16-327.1(P) E36.15
N$466: E16-328.1(P) E36.16
N$467: C36.1 E16-329.1(P)
N$468: C36.2 E16-330.1(P)
N$469: E16-331.1(P) E22.1
N$470: E16-332.1(P) E22.2
N$471: E16-333.1(P) E22.3
N$472: E16-334.1(P) E22.4
N$473: E16-335.1(P) E22.5
N$474: E16-336.1(P) E22.6
N$475: E16-337.1(P) E22.7
N$476: E16-338.1(P) E22.8
N$477: E16-339.1(P) E22.9
N$478: E16-340.1(P) E22.10
N$479: E16-341.1(P) E22.11
N$480: E16-342.1(P) E22.12
N$481: E16-343.1(P) E22.13
N$482: E16-344.1(P) E22.14
N$483: E16-345.1(P) E22.15
N$484: E16-346.1(P) E22.16
N$485: C22.1 E16-347.1(P)
N$486: C22.2 E16-348.1(P)

## Sheet 2 of 3
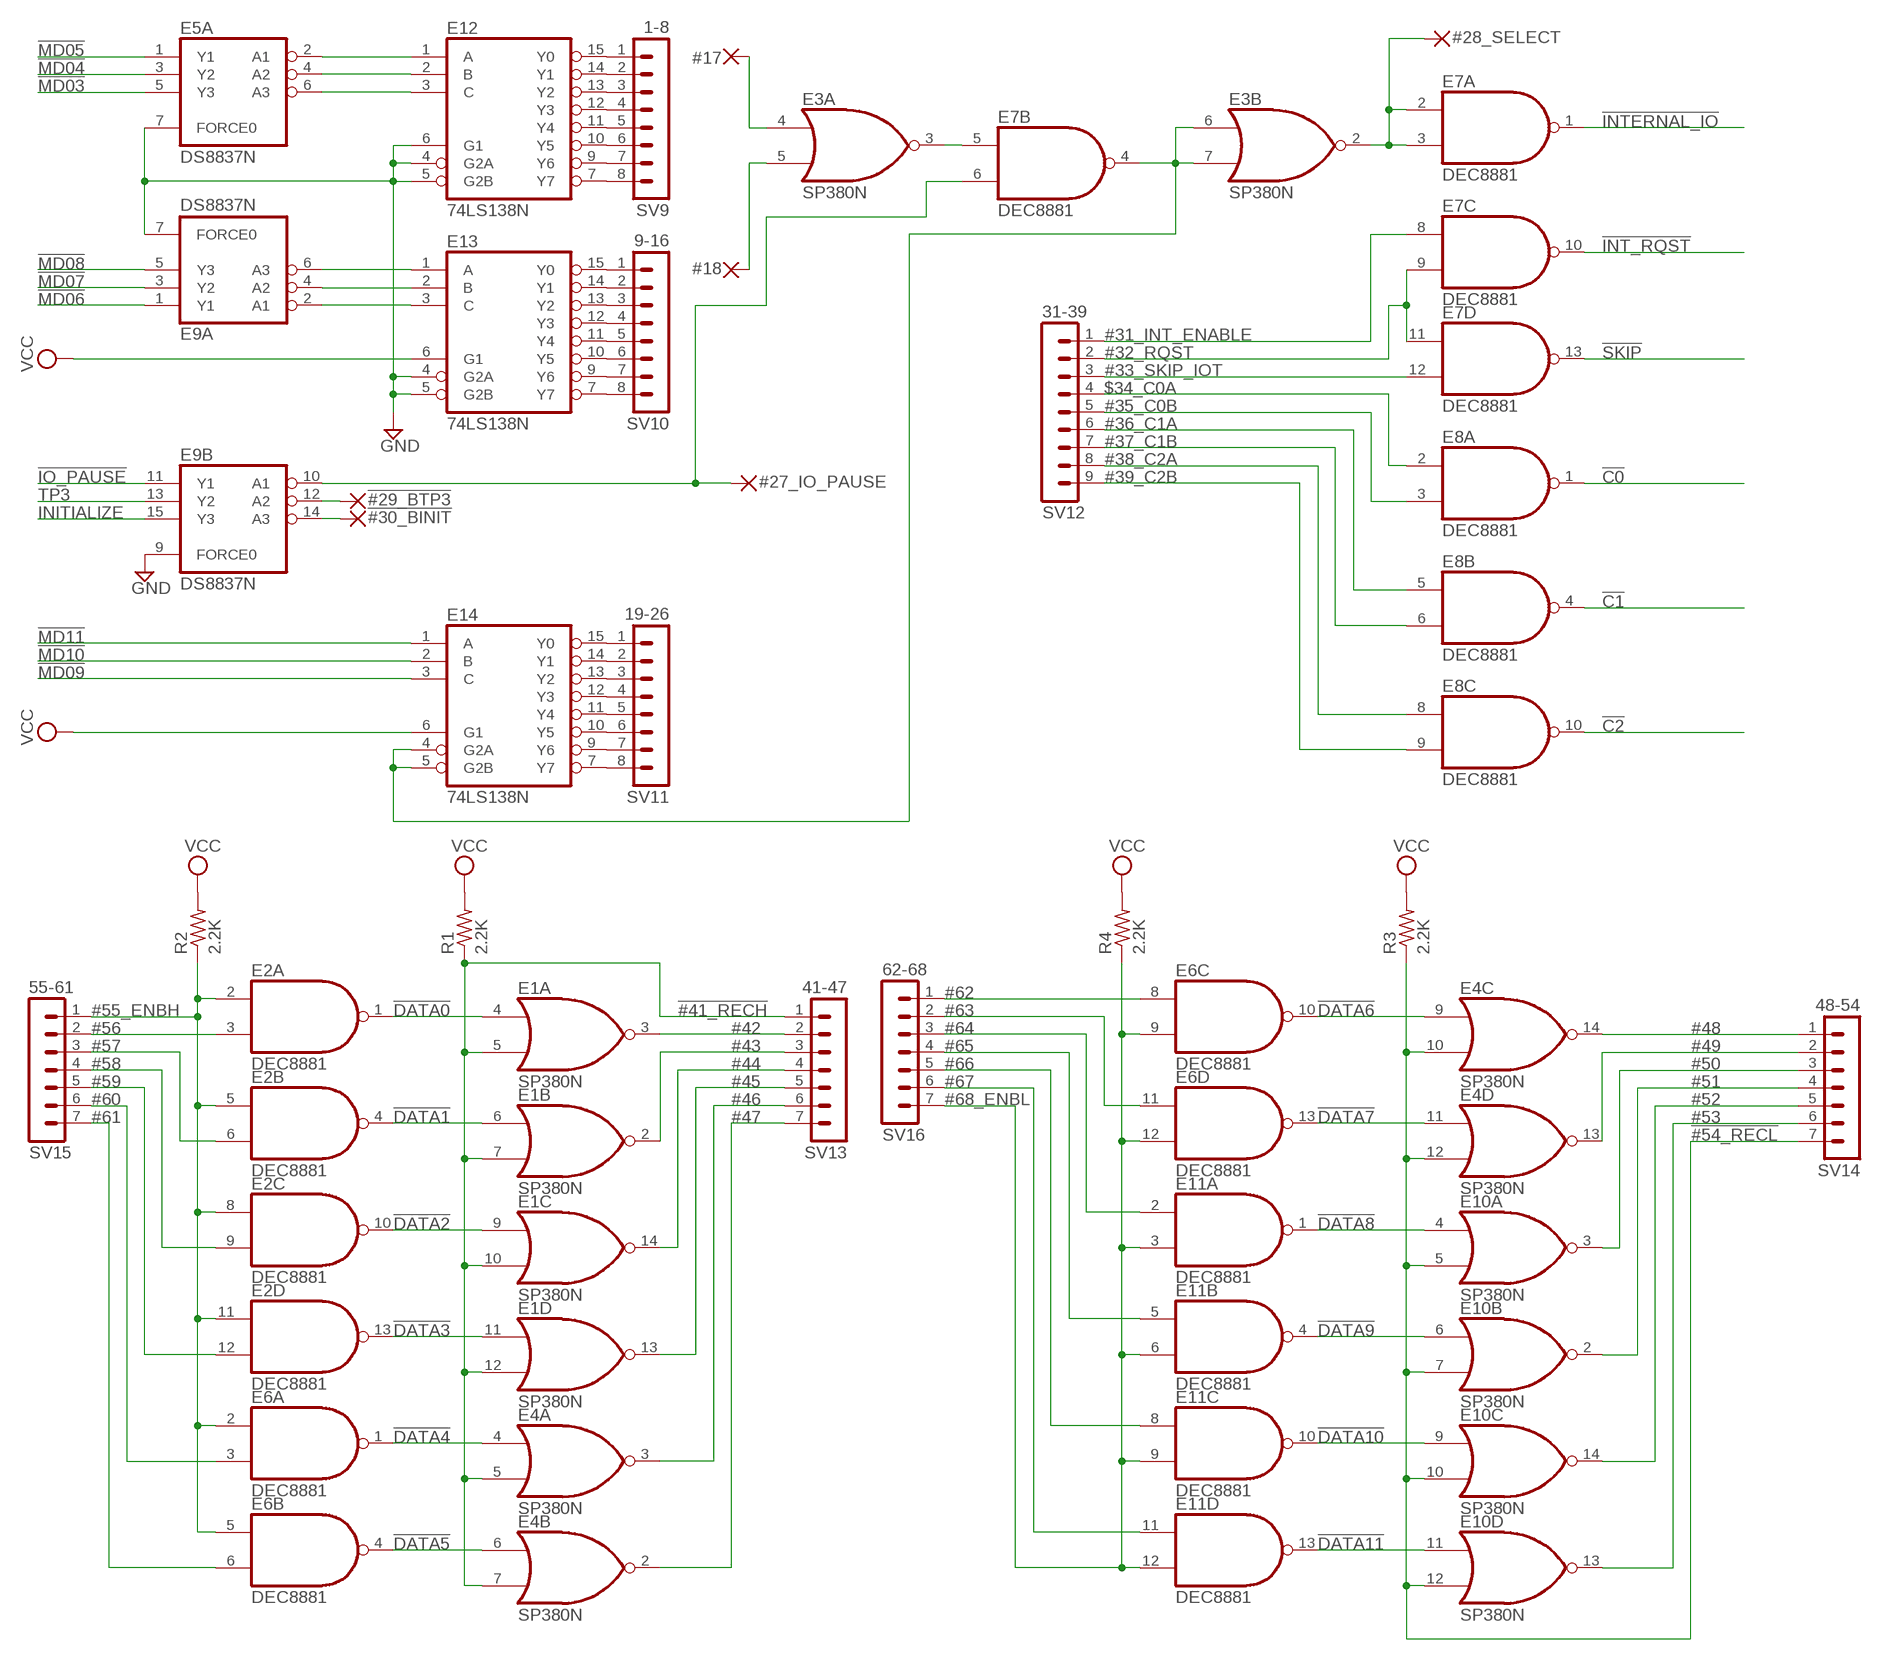
[diagram p1: schematic, sheet 2]

### Parts
!#29_BTP3  29  2,54/0,8  [2,54/0,8]
!#30_BINIT  30  2,54/0,8  [2,54/0,8]
#17  17  2,54/0,8  [2,54/0,8]
#18  18  2,54/0,8  [2,54/0,8]
#27_IO_PAUSE  27  2,54/0,8  [2,54/0,8]
#28_SELECT  28  2,54/0,8  [2,54/0,8]
E1  SP380N  [DIL14]
E2  DEC8881  N8881N  [DIL14]
E3  SP380N  [DIL14]
E4  SP380N  [DIL14]
E5  DS8837N  [DIL16]
E6  DEC8881  N8881N  [DIL14]
E7  DEC8881  N8881N  [DIL14]
E8  DEC8881  N8881N  [DIL14]
E9  DS8837N  [DIL16]
E10  SP380N  [DIL14]
E11  DEC8881  N8881N  [DIL14]
E12  74LS138N  [DIL16]
E13  74LS138N  [DIL16]
E14  74LS138N  [DIL16]
R1  2.2K  R-US_0207/10  [0207/10]
R2  2.2K  R-US_0207/10  [0207/10]
R3  2.2K  R-US_0207/10  [0207/10]
R4  2.2K  R-US_0207/10  [0207/10]
SV9  1-8  MA08-1  [MA08-1]
SV10  9-16  MA08-1  [MA08-1]
SV11  19-26  MA08-1  [MA08-1]
SV12  31-39  MA09-1  [MA09-1]
SV13  41-47  MA07-1  [MA07-1]
SV14  48-54  MA07-1  [MA07-1]
SV15  55-61  MA07-1  [MA07-1]
SV16  62-68  MA07-1  [MA07-1]

### Nets
!#41_RECH: E1.5(A:I1) E1.7(B:I1) E1.10(C:I1) E1.12(D:I1) E4.5(A:I1) E4.7(B:I1) R1.1 SV13.1
!#54_RECL: E4.10(C:I1) E4.12(D:I1) E10.5(A:I1) E10.7(B:I1) E10.10(C:I1) E10.12(D:I1) R3.1 SV14.7
!C0: E8.1(A:O) ; also sheet 3
!C1: E8.4(B:O) ; also sheet 3
!C2: E8.10(C:O) ; also sheet 3
!DATA0: E1.4(A:I0) E2.1(A:O) ; also sheet 3
!DATA1: E1.6(B:I0) E2.4(B:O) ; also sheet 3
!DATA2: E1.9(C:I0) E2.10(C:O) ; also sheet 3
!DATA3: E1.11(D:I0) E2.13(D:O) ; also sheet 3
!DATA4: E4.4(A:I0) E6.1(A:O) ; also sheet 3
!DATA5: E4.6(B:I0) E6.4(B:O) ; also sheet 3
!DATA6: E4.9(C:I0) E6.10(C:O) ; also sheet 3
!DATA7: E4.11(D:I0) E6.13(D:O) ; also sheet 3
!DATA8: E10.4(A:I0) E11.1(A:O) ; also sheet 3
!DATA9: E10.6(B:I0) E11.4(B:O) ; also sheet 3
!DATA10: E10.9(C:I0) E11.10(C:O) ; also sheet 3
!DATA11: E10.11(D:I0) E11.13(D:O) ; also sheet 3
!INT_RQST: E7.10(C:O) ; also sheet 3
!INTERNAL_IO: E7.1(A:O) ; also sheet 3
!IO_PAUSE: E9.11(B:Y1) ; also sheet 3
!MD03: E5.5(A:Y3) ; also sheet 3
!MD04: E5.3(A:Y2) ; also sheet 3
!MD05: E5.1(A:Y1) ; also sheet 3
!MD06: E9.1(A:Y1) ; also sheet 3
!MD07: E9.3(A:Y2) ; also sheet 3
!MD08: E9.5(A:Y3) ; also sheet 3
!MD09: E14.3(C) ; also sheet 3
!MD10: E14.2(B) ; also sheet 3
!MD11: E14.1(A) ; also sheet 3
!SKIP: E7.13(D:O) ; also sheet 3
#31_INT_ENABLE: E7.8(C:I0) SV12.1
#32_RQST: E7.9(C:I1) E7.11(D:I0) SV12.2
#33_SKIP_IOT: E7.12(D:I1) SV12.3
#35_C0B: E8.3(A:I1) SV12.5
#36_C1A: E8.5(B:I0) SV12.6
#37_C1B: E8.6(B:I1) SV12.7
#38_C2A: E8.8(C:I0) SV12.8
#39_C2B: E8.9(C:I1) SV12.9
#42: E1.3(A:O) SV13.2
#43: E1.2(B:O) SV13.3
#44: E1.14(C:O) SV13.4
#45: E1.13(D:O) SV13.5
#46: E4.3(A:O) SV13.6
#47: E4.2(B:O) SV13.7
#48: E4.14(C:O) SV14.1
#49: E4.13(D:O) SV14.2
#50: E10.3(A:O) SV14.3
#51: E10.2(B:O) SV14.4
#52: E10.14(C:O) SV14.5
#53: E10.13(D:O) SV14.6
#55_ENBH: E2.2(A:I0) E2.5(B:I0) E2.8(C:I0) E2.11(D:I0) E6.2(A:I0) E6.5(B:I0) R2.1 SV15.1
#56: E2.3(A:I1) SV15.2
#57: E2.6(B:I1) SV15.3
#58: E2.9(C:I1) SV15.4
#59: E2.12(D:I1) SV15.5
#60: E6.3(A:I1) SV15.6
#61: E6.6(B:I1) SV15.7
#62: E6.8(C:I0) SV16.1
#63: E6.11(D:I0) SV16.2
#64: E11.2(A:I0) SV16.3
#65: E11.5(B:I0) SV16.4
#66: E11.8(C:I0) SV16.5
#67: E11.11(D:I0) SV16.6
#68_ENBL: E6.9(C:I1) E6.12(D:I1) E11.3(A:I1) E11.6(B:I1) E11.9(C:I1) E11.12(D:I1) R4.1 SV16.7
$34_C0A: E8.2(A:I0) SV12.4
GND: E5.7(A:FORCE0) E9.7(A:FORCE0) E9.9(B:FORCE0) E12.4(G2A) E12.5(G2B) E12.6(G1) E13.4(G2A) E13.5(G2B) ; also sheet 1,3
INITIALIZE: E9.15(B:Y3) ; also sheet 3
N$487: E12.15(Y0) SV9.1
N$488: E12.14(Y1) SV9.2
N$489: E12.13(Y2) SV9.3
N$490: E12.12(Y3) SV9.4
N$491: E12.11(Y4) SV9.5
N$492: E12.10(Y5) SV9.6
N$493: E12.9(Y6) SV9.7
N$494: E12.7(Y7) SV9.8
N$495: E13.15(Y0) SV10.1
N$496: E13.14(Y1) SV10.2
N$497: E13.13(Y2) SV10.3
N$498: E13.12(Y3) SV10.4
N$499: E13.11(Y4) SV10.5
N$500: E13.10(Y5) SV10.6
N$501: E13.9(Y6) SV10.7
N$502: E13.7(Y7) SV10.8
N$503: E5.2(A:A1) E12.1(A)
N$504: E5.4(A:A2) E12.2(B)
N$505: E5.6(A:A3) E12.3(C)
N$506: E9.2(A:A1) E13.3(C)
N$507: E9.4(A:A2) E13.2(B)
N$508: E9.6(A:A3) E13.1(A)
N$509: E3.6(B:I0) E3.7(B:I1) E7.4(B:O) E14.4(G2A) E14.5(G2B)
N$510: #17.1(P) E3.4(A:I0)
N$511: #18.1(P) E3.5(A:I1)
N$512: E3.3(A:O) E7.5(B:I0)
N$513: E14.15(Y0) SV11.1
N$514: E14.14(Y1) SV11.2
N$515: E14.13(Y2) SV11.3
N$516: E14.12(Y3) SV11.4
N$517: E14.11(Y4) SV11.5
N$518: E14.10(Y5) SV11.6
N$519: E14.9(Y6) SV11.7
N$520: E14.7(Y7) SV11.8
N$521: #27_IO_PAUSE.1(P) E7.6(B:I1) E9.10(B:A1)
N$522: #28_SELECT.1(P) E3.2(B:O) E7.2(A:I0) E7.3(A:I1)
N$523: !#30_BINIT.1(P) E9.14(B:A3)
N$524: !#29_BTP3.1(P) E9.12(B:A2)
TP3: E9.13(B:Y2) ; also sheet 3
VCC: E13.6(G1) E14.6(G1) R1.2 R2.2 R3.2 R4.2 ; also sheet 3
Unconnected: E3.9(C:I0) E3.10(C:I1) E3.11(D:I0) E3.12(D:I1) E3.13(D:O) E3.14(C:O) E5.9(B:FORCE0) E5.10(B:A1) E5.11(B:Y1) E5.12(B:A2) E5.13(B:Y2) E5.14(B:A3) E5.15(B:Y3) E8.11(D:I0) E8.12(D:I1) E8.13(D:O)

## Sheet 3 of 3
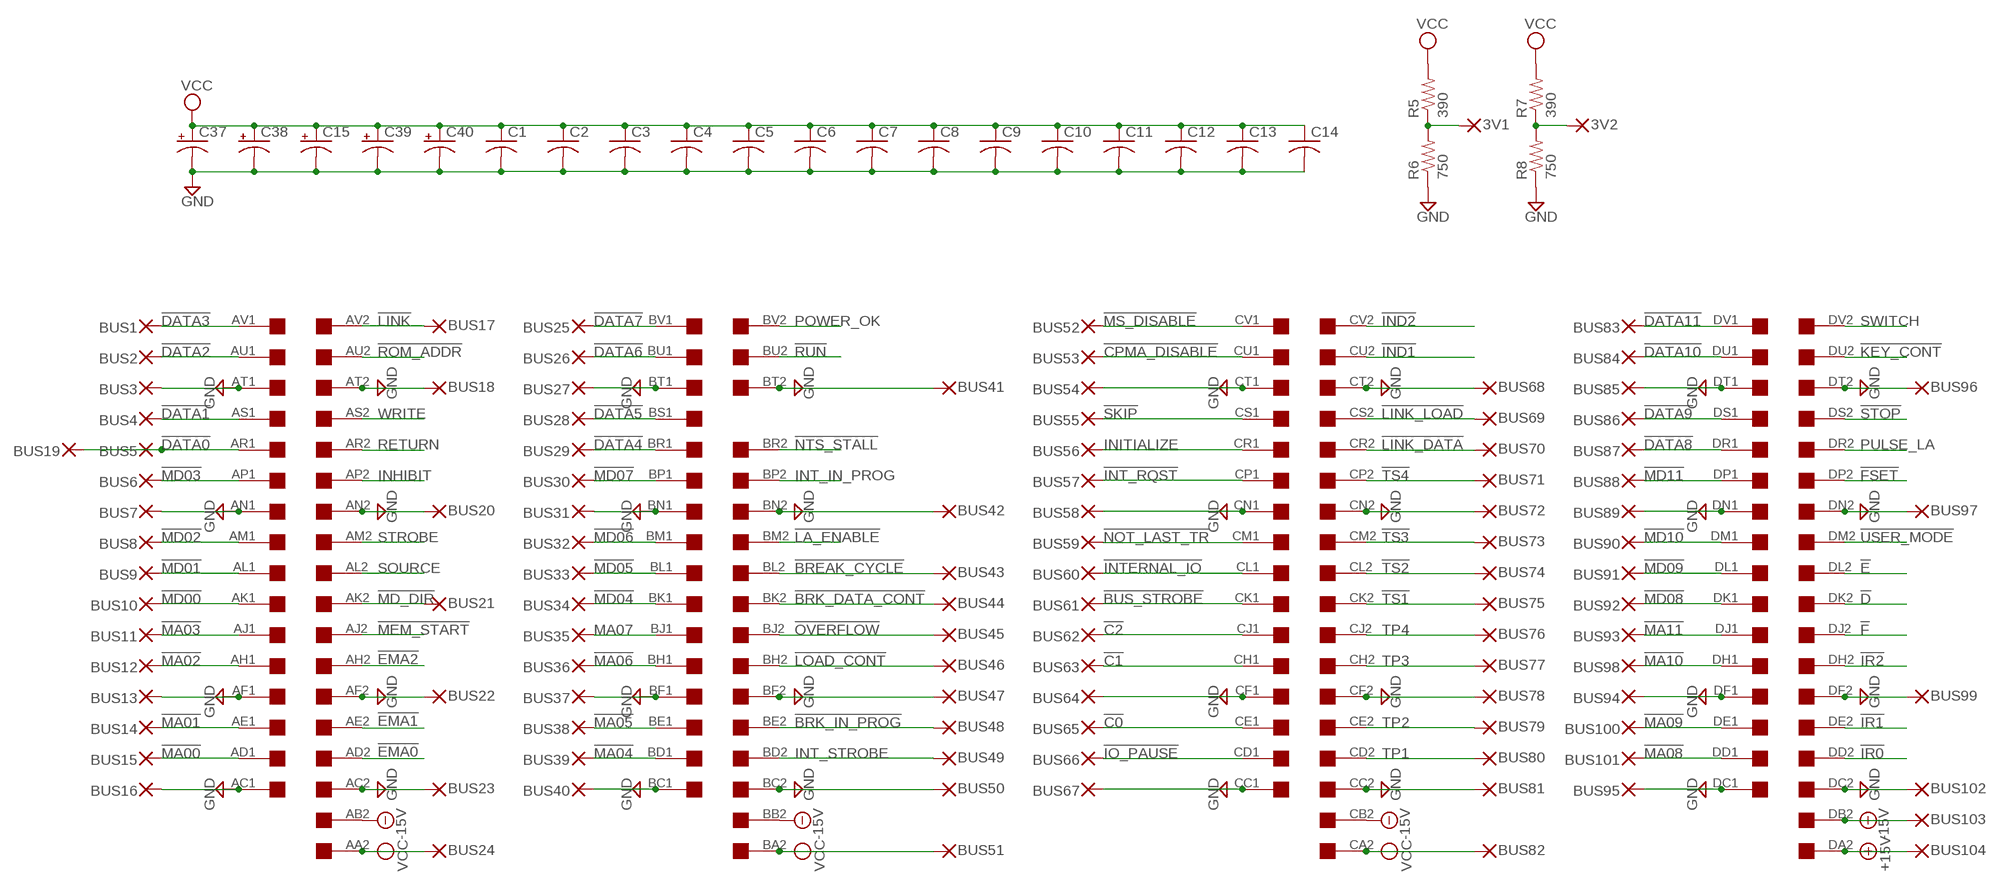
[diagram p2: schematic, sheet 3]

### Parts
3V1  2,54/0,8  [2,54/0,8]
3V2  2,54/0,8  [2,54/0,8]
BUS1  2,54/0,8  [2,54/0,8]
BUS2  2,54/0,8  [2,54/0,8]
BUS3  2,54/0,8  [2,54/0,8]
BUS4  2,54/0,8  [2,54/0,8]
BUS5  2,54/0,8  [2,54/0,8]
BUS6  2,54/0,8  [2,54/0,8]
BUS7  2,54/0,8  [2,54/0,8]
BUS8  2,54/0,8  [2,54/0,8]
BUS9  2,54/0,8  [2,54/0,8]
BUS10  2,54/0,8  [2,54/0,8]
BUS11  2,54/0,8  [2,54/0,8]
BUS12  2,54/0,8  [2,54/0,8]
BUS13  2,54/0,8  [2,54/0,8]
BUS14  2,54/0,8  [2,54/0,8]
BUS15  2,54/0,8  [2,54/0,8]
BUS16  2,54/0,8  [2,54/0,8]
BUS17  2,54/0,8  [2,54/0,8]
BUS18  2,54/0,8  [2,54/0,8]
BUS19  2,54/0,8  [2,54/0,8]
BUS20  2,54/0,8  [2,54/0,8]
BUS21  2,54/0,8  [2,54/0,8]
BUS22  2,54/0,8  [2,54/0,8]
BUS23  2,54/0,8  [2,54/0,8]
BUS24  2,54/0,8  [2,54/0,8]
BUS25  2,54/0,8  [2,54/0,8]
BUS26  2,54/0,8  [2,54/0,8]
BUS27  2,54/0,8  [2,54/0,8]
BUS28  2,54/0,8  [2,54/0,8]
BUS29  2,54/0,8  [2,54/0,8]
BUS30  2,54/0,8  [2,54/0,8]
BUS31  2,54/0,8  [2,54/0,8]
BUS32  2,54/0,8  [2,54/0,8]
BUS33  2,54/0,8  [2,54/0,8]
BUS34  2,54/0,8  [2,54/0,8]
BUS35  2,54/0,8  [2,54/0,8]
BUS36  2,54/0,8  [2,54/0,8]
BUS37  2,54/0,8  [2,54/0,8]
BUS38  2,54/0,8  [2,54/0,8]
BUS39  2,54/0,8  [2,54/0,8]
BUS40  2,54/0,8  [2,54/0,8]
BUS41  2,54/0,8  [2,54/0,8]
BUS42  2,54/0,8  [2,54/0,8]
BUS43  2,54/0,8  [2,54/0,8]
BUS44  2,54/0,8  [2,54/0,8]
BUS45  2,54/0,8  [2,54/0,8]
BUS46  2,54/0,8  [2,54/0,8]
BUS47  2,54/0,8  [2,54/0,8]
BUS48  2,54/0,8  [2,54/0,8]
BUS49  2,54/0,8  [2,54/0,8]
BUS50  2,54/0,8  [2,54/0,8]
BUS51  2,54/0,8  [2,54/0,8]
BUS52  2,54/0,8  [2,54/0,8]
BUS53  2,54/0,8  [2,54/0,8]
BUS54  2,54/0,8  [2,54/0,8]
BUS55  2,54/0,8  [2,54/0,8]
BUS56  2,54/0,8  [2,54/0,8]
BUS57  2,54/0,8  [2,54/0,8]
BUS58  2,54/0,8  [2,54/0,8]
BUS59  2,54/0,8  [2,54/0,8]
BUS60  2,54/0,8  [2,54/0,8]
BUS61  2,54/0,8  [2,54/0,8]
BUS62  2,54/0,8  [2,54/0,8]
BUS63  2,54/0,8  [2,54/0,8]
BUS64  2,54/0,8  [2,54/0,8]
BUS65  2,54/0,8  [2,54/0,8]
BUS66  2,54/0,8  [2,54/0,8]
BUS67  2,54/0,8  [2,54/0,8]
BUS68  2,54/0,8  [2,54/0,8]
BUS69  2,54/0,8  [2,54/0,8]
BUS70  2,54/0,8  [2,54/0,8]
BUS71  2,54/0,8  [2,54/0,8]
BUS72  2,54/0,8  [2,54/0,8]
BUS73  2,54/0,8  [2,54/0,8]
BUS74  2,54/0,8  [2,54/0,8]
BUS75  2,54/0,8  [2,54/0,8]
BUS76  2,54/0,8  [2,54/0,8]
BUS77  2,54/0,8  [2,54/0,8]
BUS78  2,54/0,8  [2,54/0,8]
BUS79  2,54/0,8  [2,54/0,8]
BUS80  2,54/0,8  [2,54/0,8]
BUS81  2,54/0,8  [2,54/0,8]
BUS82  2,54/0,8  [2,54/0,8]
BUS83  2,54/0,8  [2,54/0,8]
BUS84  2,54/0,8  [2,54/0,8]
BUS85  2,54/0,8  [2,54/0,8]
BUS86  2,54/0,8  [2,54/0,8]
BUS87  2,54/0,8  [2,54/0,8]
BUS88  2,54/0,8  [2,54/0,8]
BUS89  2,54/0,8  [2,54/0,8]
BUS90  2,54/0,8  [2,54/0,8]
BUS91  2,54/0,8  [2,54/0,8]
BUS92  2,54/0,8  [2,54/0,8]
BUS93  2,54/0,8  [2,54/0,8]
BUS94  2,54/0,8  [2,54/0,8]
BUS95  2,54/0,8  [2,54/0,8]
BUS96  2,54/0,8  [2,54/0,8]
BUS97  2,54/0,8  [2,54/0,8]
BUS98  2,54/0,8  [2,54/0,8]
BUS99  2,54/0,8  [2,54/0,8]
BUS100  2,54/0,8  [2,54/0,8]
BUS101  2,54/0,8  [2,54/0,8]
BUS102  2,54/0,8  [2,54/0,8]
BUS103  2,54/0,8  [2,54/0,8]
BUS104  2,54/0,8  [2,54/0,8]
C1  C-US075-032X103  [C075-032X103]
C2  C-US075-032X103  [C075-032X103]
C3  C-US075-032X103  [C075-032X103]
C4  C-US075-032X103  [C075-032X103]
C5  C-US075-032X103  [C075-032X103]
C6  C-US075-032X103  [C075-032X103]
C7  C-US075-032X103  [C075-032X103]
C8  C-US075-032X103  [C075-032X103]
C9  C-US075-032X103  [C075-032X103]
C10  C-US075-032X103  [C075-032X103]
C11  C-US075-032X103  [C075-032X103]
C12  C-US075-032X103  [C075-032X103]
C13  C-US075-032X103  [C075-032X103]
C14  C-US075-032X103  [C075-032X103]
C15  CPOL-USE22-6AXIAL  [E22-6]
C37  CPOL-USE22-6AXIAL  [E22-6]
C38  CPOL-USE22-6AXIAL  [E22-6]
C39  CPOL-USE22-6AXIAL  [E22-6]
C40  CPOL-USE22-6AXIAL  [E22-6]
R5  390  R-US_0207/10  [0207/10]
R6  750  R-US_0207/10  [0207/10]
R7  390  R-US_0207/10  [0207/10]
R8  750  R-US_0207/10  [0207/10]
U$2  QUAD  [EDGE-CON8]

### Nets
!BREAK_CYCLE: BUS43.1(P) U$2.BL2
!BRK_DATA_CONT: BUS44.1(P) U$2.BK2
!BRK_IN_PROG: BUS48.1(P) U$2.BE2
!BUS_STROBE: BUS61.1(P) U$2.CK1
!C0: BUS65.1(P) U$2.CE1 ; also sheet 2
!C1: BUS63.1(P) U$2.CH1 ; also sheet 2
!C2: BUS62.1(P) U$2.CJ1 ; also sheet 2
!CPMA_DISABLE: BUS53.1(P) U$2.CU1
!D: U$2.DK2
!DATA0: BUS5.1(P) BUS19.1(P) U$2.AR1 ; also sheet 2
!DATA1: BUS4.1(P) U$2.AS1 ; also sheet 2
!DATA2: BUS2.1(P) U$2.AU1 ; also sheet 2
!DATA3: BUS1.1(P) U$2.AV1 ; also sheet 2
!DATA4: BUS29.1(P) U$2.BR1 ; also sheet 2
!DATA5: BUS28.1(P) U$2.BS1 ; also sheet 2
!DATA6: BUS26.1(P) U$2.BU1 ; also sheet 2
!DATA7: BUS25.1(P) U$2.BV1 ; also sheet 2
!DATA8: BUS87.1(P) U$2.DR1 ; also sheet 2
!DATA9: BUS86.1(P) U$2.DS1 ; also sheet 2
!DATA10: BUS84.1(P) U$2.DU1 ; also sheet 2
!DATA11: BUS83.1(P) U$2.DV1 ; also sheet 2
!E: U$2.DL2
!EMA0: U$2.AD2
!EMA1: U$2.AE2
!EMA2: U$2.AH2
!F: U$2.DJ2
!FSET: U$2.DP2
!IND1: U$2.CU2
!IND2: U$2.CV2
!INT_RQST: BUS57.1(P) U$2.CP1 ; also sheet 2
!INTERNAL_IO: BUS60.1(P) U$2.CL1 ; also sheet 2
!IO_PAUSE: BUS66.1(P) U$2.CD1 ; also sheet 2
!IR0: U$2.DD2
!IR1: U$2.DE2
!IR2: U$2.DH2
!KEY_CONT: U$2.DU2
!LA_ENABLE: U$2.BM2
!LINK: BUS17.1(P) U$2.AV2
!LINK_DATA: BUS70.1(P) U$2.CR2
!LINK_LOAD: BUS69.1(P) U$2.CS2
!LOAD_CONT: BUS46.1(P) U$2.BH2
!MA00: BUS15.1(P) U$2.AD1
!MA01: BUS14.1(P) U$2.AE1
!MA02: BUS12.1(P) U$2.AH1
!MA03: BUS11.1(P) U$2.AJ1
!MA04: BUS39.1(P) U$2.BD1
!MA05: BUS38.1(P) U$2.BE1
!MA06: BUS36.1(P) U$2.BH1
!MA08: BUS101.1(P) U$2.DD1
!MA09: BUS100.1(P) U$2.DE1
!MA10: BUS98.1(P) U$2.DH1
!MA11: BUS93.1(P) U$2.DJ1
!MD00: BUS10.1(P) U$2.AK1
!MD01: BUS9.1(P) U$2.AL1
!MD02: BUS8.1(P) U$2.AM1
!MD03: BUS6.1(P) U$2.AP1 ; also sheet 2
!MD04: BUS34.1(P) U$2.BK1 ; also sheet 2
!MD05: BUS33.1(P) U$2.BL1 ; also sheet 2
!MD06: BUS32.1(P) U$2.BM1 ; also sheet 2
!MD07: BUS30.1(P) U$2.BP1 ; also sheet 2
!MD08: BUS92.1(P) U$2.DK1 ; also sheet 2
!MD09: BUS91.1(P) U$2.DL1 ; also sheet 2
!MD10: BUS90.1(P) U$2.DM1 ; also sheet 2
!MD11: BUS88.1(P) U$2.DP1 ; also sheet 2
!MD_DIR: BUS21.1(P) U$2.AK2
!MEM_START: U$2.AJ2
!MS_DISABLE: BUS52.1(P) U$2.CV1
!NOT_LAST_TR: BUS59.1(P) U$2.CM1
!NTS_STALL: U$2.BR2
!OVERFLOW: BUS45.1(P) U$2.BJ2
!ROM_ADDR: U$2.AU2
!RUN: U$2.BU2
!SKIP: BUS55.1(P) U$2.CS1 ; also sheet 2
!STOP: U$2.DS2
!TS1: BUS75.1(P) U$2.CK2
!TS2: BUS74.1(P) U$2.CL2
!TS3: BUS73.1(P) U$2.CM2
!TS4: BUS71.1(P) U$2.CP2
!USER_MODE: U$2.DM2
+15V: BUS104.1(P) U$2.DA2
-15V [supply]: BUS103.1(P) U$2.AB2 U$2.BB2 U$2.CB2 U$2.DB2
GND: BUS3.1(P) BUS7.1(P) BUS13.1(P) BUS16.1(P) BUS18.1(P) BUS20.1(P) BUS22.1(P) BUS23.1(P) BUS27.1(P) BUS31.1(P) BUS37.1(P) BUS40.1(P) BUS41.1(P) BUS42.1(P) BUS47.1(P) BUS50.1(P) BUS54.1(P) BUS58.1(P) BUS64.1(P) BUS67.1(P) BUS68.1(P) BUS72.1(P) BUS78.1(P) BUS81.1(P) BUS85.1(P) BUS89.1(P) BUS94.1(P) BUS95.1(P) BUS96.1(P) BUS97.1(P) BUS99.1(P) BUS102.1(P) C1.2 C2.2 C3.2 C4.2 C5.2 C6.2 C7.2 C8.2 C9.2 C10.2 C11.2 C12.2 C13.2 C14.2 C15.- C37.- C38.- C39.- C40.- R6.1 R8.1 U$2.AC1 U$2.AC2 U$2.AF1 U$2.AF2 U$2.AN1 U$2.AN2 U$2.AT1 U$2.AT2 U$2.BC1 U$2.BC2 U$2.BF1 U$2.BF2 U$2.BN1 U$2.BN2 U$2.BT1 U$2.BT2 U$2.CC1 U$2.CC2 U$2.CF1 U$2.CF2 U$2.CN1 U$2.CN2 U$2.CT1 U$2.CT2 U$2.DC1 U$2.DC2 U$2.DF1 U$2.DF2 U$2.DN1 U$2.DN2 U$2.DT1 U$2.DT2 ; also sheet 1,2
INHIBIT: U$2.AP2
INITIALIZE: BUS56.1(P) U$2.CR1 ; also sheet 2
INT_IN_PROG: U$2.BP2
INT_STROBE: BUS49.1(P) U$2.BD2
MA07: BUS35.1(P) U$2.BJ1
N$525: 3V1.1(P) R5.1 R6.2
N$526: 3V2.1(P) R7.1 R8.2
POWER_OK: U$2.BV2
PULSE_LA: U$2.DR2
RETURN: U$2.AR2
SOURCE: U$2.AL2
STROBE: U$2.AM2
SWITCH: U$2.DV2
TP1: BUS80.1(P) U$2.CD2
TP2: BUS79.1(P) U$2.CE2
TP3: BUS77.1(P) U$2.CH2 ; also sheet 2
TP4: BUS76.1(P) U$2.CJ2
VCC: BUS24.1(P) BUS51.1(P) BUS82.1(P) C1.1 C2.1 C3.1 C4.1 C5.1 C6.1 C7.1 C8.1 C9.1 C10.1 C11.1 C12.1 C13.1 C14.1 C15.+ C37.+ C38.+ C39.+ C40.+ R5.2 R7.2 U$2.AA2 U$2.BA2 U$2.CA2 ; also sheet 2
WRITE: U$2.AS2
Unconnected: U$2.AA1 U$2.AB1 U$2.BA1 U$2.BB1 U$2.BS2 U$2.CA1 U$2.CB1 U$2.DA1 U$2.DB1

## Power pins joined to a net without a drawn wire
GND: E1.1(P:GND) E2.7(P:GND) E3.1(P:GND) E4.1(P:GND) E5.8(P:GND) E6.7(P:GND) E7.7(P:GND) E8.7(P:GND) E9.8(P:GND) E10.1(P:GND) E11.7(P:GND) E12.8(GND) E13.8(GND) E14.8(GND)
VCC: E1.8(P:VCC) E2.14(P:VCC) E3.8(P:VCC) E4.8(P:VCC) E5.16(P:VCC) E6.14(P:VCC) E7.14(P:VCC) E8.14(P:VCC) E9.16(P:VCC) E10.8(P:VCC) E11.14(P:VCC) E12.16(VCC) E13.16(VCC) E14.16(VCC)

## Library data of the parts
3V1 3V2 !#29_BTP3 !#30_BINIT #17 #18 #27_IO_PAUSE #28_SELECT BUS1-BUS104 E16-19-E16-40 E16-65-E16-348 FA1 FA2 FB1 FB2 FC1 FC2 FD1 FD2 FE1 FE2 FF1 FF2 FH1 FH2 FJ1 FJ2 FK1 FK2 FL1 FL2 FM1 FM2 FN1 FN2 FP1 FP2 FR1 FR2 FS1 FS2 FT1 FT2 FU1 FU2 FV1 FV2 HA1 HA2 HB1 HB2 HC1 HC2 HD1 HD2 HE1 HE2 HF1 HF2 HH1 HH2 HJ1 HJ2 HK1 HK2 HL1 HL2 HM1 HM2 HN1 HN2 HP1 HP2 HR1 HR2 HS1 HS2 HT1 HT2 HU1 HU2 HV1 HV2 J1BB J1BB1 J1D J1D1 J1DD J1DD1 J1F J1F1 J1FF J1FF1 J1J J1J1 J1JJ J1JJ1 J1L J1L1 J1LL J1LL1 J1N J1N1 J1NN J1NN1 J1R J1R1 J1RR J1RR1 J1T J1T1 J1TT J1TT1 J1V J1V1 J1X J1X1 J1Z J1Z1 = wirepad:2,54/0,8: THROUGH-HOLE PAD
C1-C14 C16-C36 = rcl:C-US: CAPACITOR, American symbol
C1-1 C1-2 E16-1-E16-16 E17-1-E17-24 E18-1-E18-24 E19-1-E19-24 = wirepad:1,6/0,8: THROUGH-HOLE PAD
C15 C37-C40 = rcl:CPOL-US: POLARIZED CAPACITOR, American symbol
E1 E3 E4 E10 = dec-con:SP380: Quad NOR gate (use 8640)
E2 E6-E8 E11 = dec-con:N8881: Quad 2-input NAND gate, open collector
E5 E9 = dec-con:DS8837: Hex inverting LINE RECEIVER
E12-E14 = 74xx-us:74*138: 3-line to 8-line DECODER/DEMULTIPLEXER
E16-E36 = ic-package:DIL16: Dual In Line / Socket
F H = dec-con:SINGLE: Single-Height DEC board
J1 = dec-con:DEC40PIN: PIN HEADER
R1-R8 = rcl:R-US_: RESISTOR, American symbol
SV1-SV6 = con-lstb:MA12-1: PIN HEADER; OC_FARNELL: unknown; OC_NEWARK: unknown
SV7-SV11 = con-lstb:MA08-1: PIN HEADER; OC_FARNELL: unknown; OC_NEWARK: unknown
SV12 = con-lstb:MA09-1: PIN HEADER; OC_FARNELL: unknown; OC_NEWARK: unknown
SV13-SV16 = con-lstb:MA07-1: PIN HEADER; OC_FARNELL: unknown; OC_NEWARK: unknown
U$2 = dec-con:QUAD: Quad-Height DEC board

## Net classes
1 supply: width 0.762 mm